# EAGLE design LB_BIT_i13_LIGHTSENSOR-v02(rev1) 01 (EAGLE 6.1)
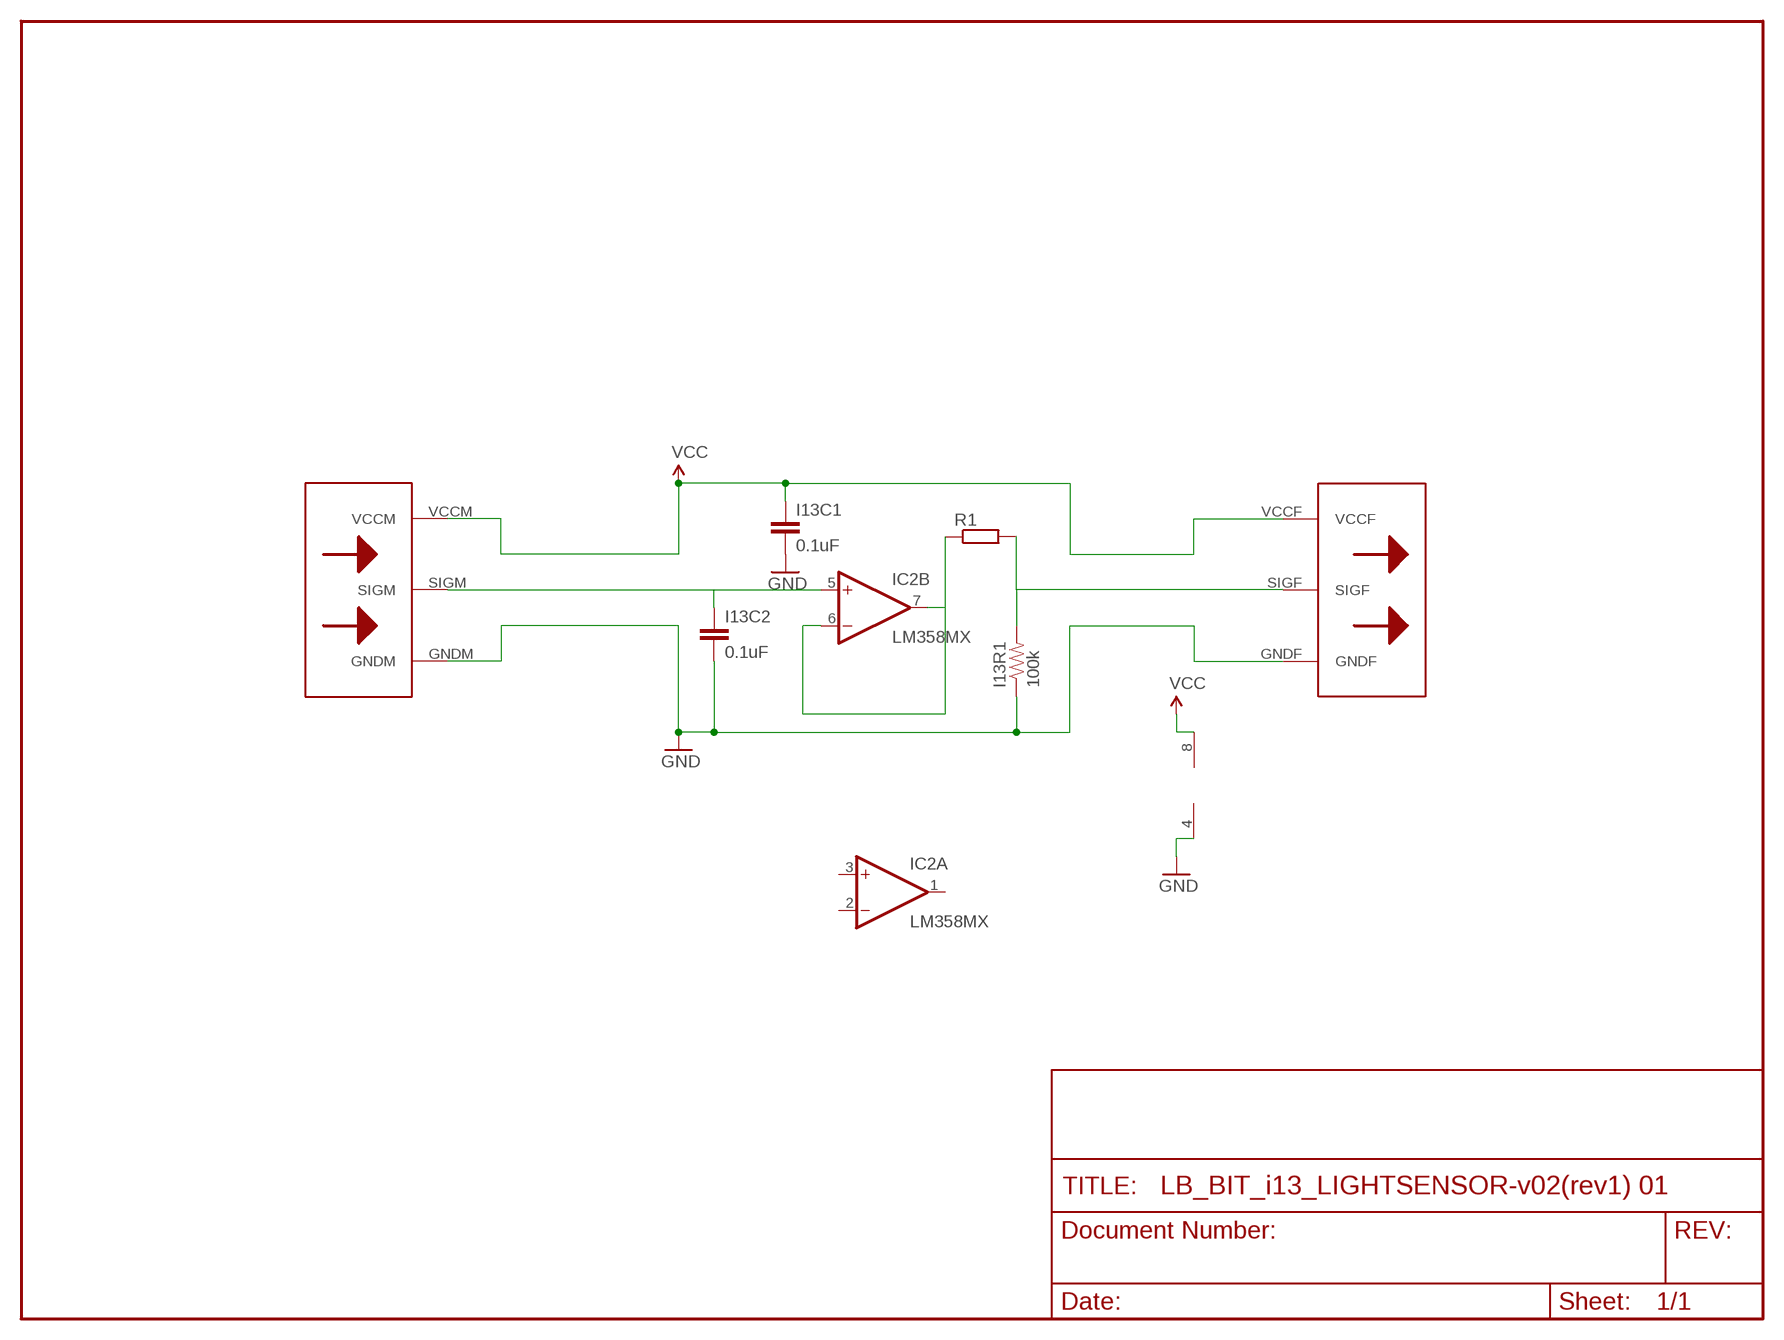
[diagram p0: schematic, sheet 1]

## Parts
I13C1  0.1uF  CAP1206  [1206]
I13C2  0.1uF  CAP1206  [1206]
I13R1  100k  RESISTOR0805-RES  [0805]
IC2  LM358MX  [SO08]
R1  R-EU_R2512  [R2512]
U$1  BIGBIT  [BIGBIT]

## Nets
GND: I13C1.2 I13C2.2 I13R1.1 IC2.4(P:V-) U$1.GNDF U$1.GNDM
N$6: IC2.6(B:-IN) IC2.7(B:OUT) R1.1
PS: I13R1.2 R1.2 U$1.SIGF
SIG: I13C2.1 IC2.5(B:+IN) U$1.SIGM
VCC: I13C1.1 IC2.8(P:V+) U$1.VCCF U$1.VCCM
Unconnected: IC2.1(A:OUT) IC2.2(A:-IN) IC2.3(A:+IN)

## Library data of the parts
I13C1 I13C2 = SparkFun:CAP: Capacitor Standard 0603 ceramic capacitor, and 0.1" leaded capacitor.
I13R1 = SparkFun:RESISTOR: Resistor Basic schematic elements and footprints for 0603, 1206, and PTH resistors.
IC2 = linear:LM358: OP AMP also LM158; LM258; LM2904 Source: http://cache.national.com/ds/LM/LM158.pdf
R1 = rcl:R-EU_: RESISTOR, European symbol
U$1 = bigbits:BIGBIT: BigBit completo Male entra o Sinal Female sai o Sinal Esquerda --> Direita

## Board
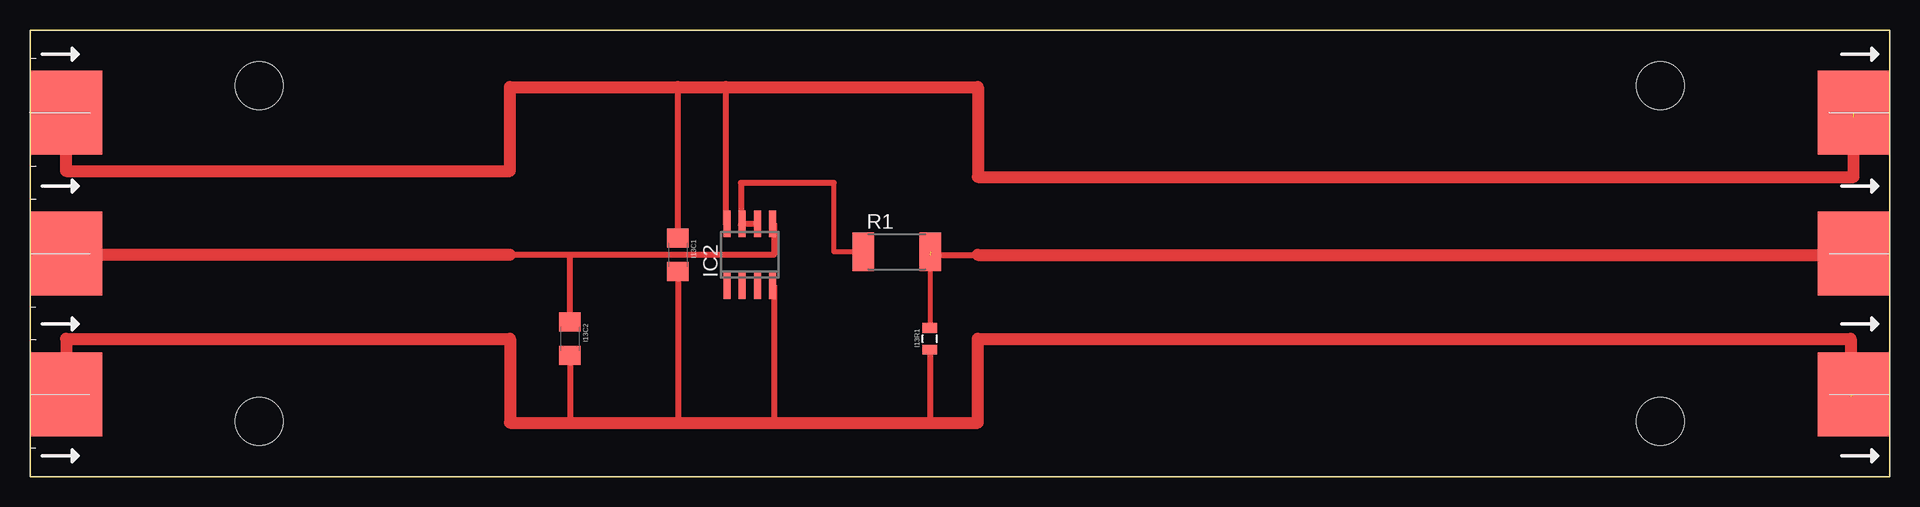
[diagram p1: board, top side]

Size 155 x 37.25 mm. Coordinates in mm from the lower left corner, seen from the top.
Outline: 0,0 155,0 155,37.25 0,37.25 0,0
Copper layers (1*16): Top 0.035mm / dielectric 1.5mm / Bottom 0.035mm
Design rules: minimum track width 10mil, minimum drill 24mil, track to track 8mil, track to pad 8mil, pad to pad 8mil, via to via 8mil, smd to smd 8mil, copper to edge 40mil, drill to drill 8mil, minimum pad ring 10mil, minimum via ring 8mil, stop-mask expansion 4mil, vias tented up to drill 0mil, thermal gap 10mil

### Footprints (pad centres in the part's own frame; a part is rotated, then mirrored left to right if it is on the bottom)
1206 = smd 1.6 x 1.8: 1 -1.4,0; 2 1.4,0
0805 = smd 0.8 x 1.2: 1 -0.9,0; 2 0.9,0
SO08 = smd 0.6 x 2.2: 1 -1.905,-2.6; 2 -0.635,-2.6; 3 0.635,-2.6; 4 1.905,-2.6; 5 1.905,2.6; 6 0.635,2.6; 7 -0.635,2.6; 8 -1.905,2.6
R2512 = smd 1.8 x 3.2: 1 -2.8,0; 2 2.8,0
BIGBIT = smd 6 x 7: GNDF 152,-30.38; GNDM 3,-30.38; SIGF 152,-18.64; SIGM 3,-18.64; VCCF 152,-6.89; VCCM 3,-6.89 | hole 4: 135.9,-4.64; 135.9,-32.639; 19.1,-4.64; 19.1,-32.639

### Placement (x,y rotation side)
I13C1  54,18.5 270 top
I13C2  45,11.5 270 top
I13R1  75,11.5 90 top
IC2  60,18.5 0 top
R1  72.25,18.75 0 top
U$1  0,37.25 0 top

### Tracks (layer width: path | path; a pad name or v marks a point on that pad's centre or on a via)
GND  (1 unrouted)
  Top 0.5: I13C2.2 45,4.5 | I13C1.2 54,4.5 | I13R1.1 75,4.5 | IC2.4 62,15.9 62,4.5
  Top 1: U$1.GNDM 3,11.5 40,11.5 40,4.5 45,4.5 54,4.5 62,4.5 75,4.5 79,4.5 79,11.5 151.75,11.5 151.75,6.75
N$6
  Top 0.406: R1.1 67,18.75 67,24.5
  Top 0.5: 67,24.5 59.25,24.5 59.25,21 59.37,21 IC2.7 IC2.6
PS  (1 unrouted)
  Top 0.406: I13R1.2 75.05,12.4 R1.2
  Top 0.5: 75,18.5 79,18.5
  Top 1: 79,18.5 152,18.5 U$1.SIGF
SIG
  Top 0.5: I13C2.1 45,18.5 | 45,18.5 40,18.5 | IC2.5 62,21.1 62,18.5 45,18.5
  Top 1: 40,18.5 4,18.5 | 4,18.5 4,19 | 4,18.5 3,18.5 U$1.SIGM
VCC  (1 unrouted)
  Top 0.5: I13C1.1 54,32.5 | IC2.8 58,21.1 58,32.5
  Top 1: U$1.VCCM 3,25.5 40,25.5 40,32.5 54,32.5 58,32.5 79,32.5 79,25 152,25 152,30